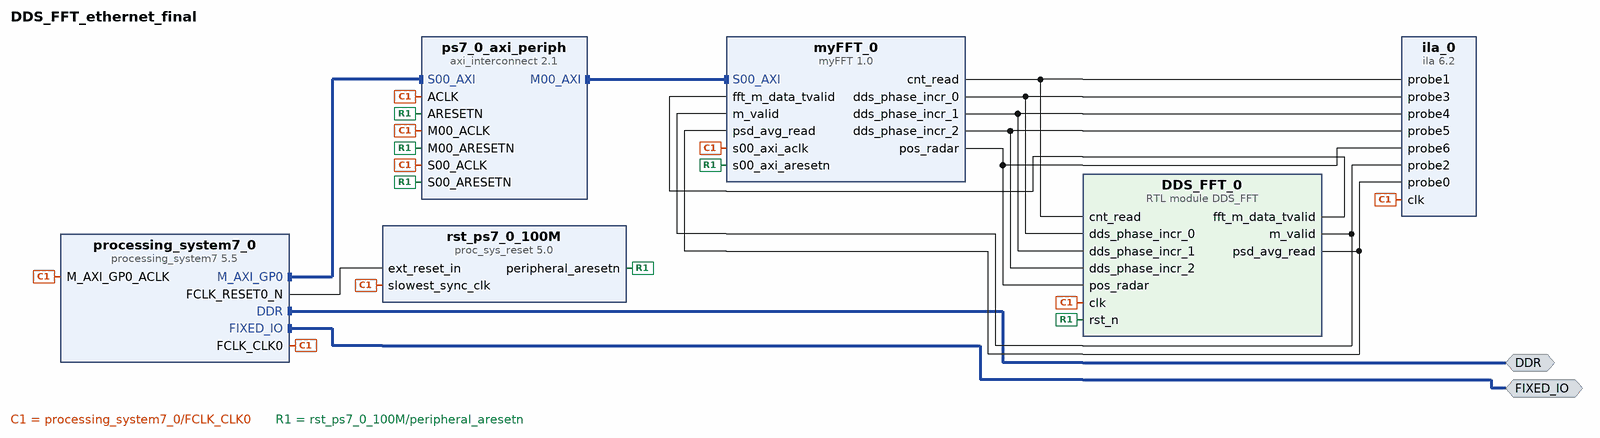
[diagram p0: block diagram of the top level]
# Vivado block design DDS_FFT_ethernet_final, xc7z020clg400-2, Vivado 2022.2
create_bd_design DDS_FFT_ethernet_final

create_bd_intf_port -mode Master -vlnv xilinx.com:interface:ddrx_rtl:1.0 DDR
create_bd_intf_port -mode Master -vlnv xilinx.com:display_processing_system7:fixedio_rtl:1.0 FIXED_IO

create_bd_cell -type ip -vlnv xilinx.com:ip:processing_system7:5.5 processing_system7_0
set_property -dict [list \
  CONFIG.PCW_ENET0_ENET0_IO {MIO 16 .. 27} \
  CONFIG.PCW_ENET0_GRP_MDIO_ENABLE 1 \
  CONFIG.PCW_ENET0_GRP_MDIO_IO {MIO 52 .. 53} \
  CONFIG.PCW_ENET0_PERIPHERAL_ENABLE 1 \
  CONFIG.PCW_ENET0_RESET_ENABLE 0 \
  CONFIG.PCW_ENET_RESET_ENABLE 1 \
  CONFIG.PCW_ENET_RESET_SELECT {Share reset pin} \
  CONFIG.PCW_FPGA0_PERIPHERAL_FREQMHZ 100 \
  CONFIG.PCW_GPIO_MIO_GPIO_ENABLE 1 \
  CONFIG.PCW_GPIO_MIO_GPIO_IO MIO \
  CONFIG.PCW_I2C_RESET_ENABLE 1 \
  CONFIG.PCW_PRESET_BANK1_VOLTAGE {LVCMOS 1.8V} \
  CONFIG.PCW_QSPI_GRP_SINGLE_SS_ENABLE 1 \
  CONFIG.PCW_QSPI_GRP_SINGLE_SS_IO {MIO 1 .. 6} \
  CONFIG.PCW_QSPI_PERIPHERAL_ENABLE 1 \
  CONFIG.PCW_QSPI_QSPI_IO {MIO 1 .. 6} \
  CONFIG.PCW_SINGLE_QSPI_DATA_MODE x4 \
  CONFIG.PCW_UART1_PERIPHERAL_ENABLE 1 \
  CONFIG.PCW_UART1_UART1_IO {MIO 48 .. 49} \
  CONFIG.PCW_UART_PERIPHERAL_FREQMHZ 100 \
  CONFIG.PCW_UIPARAM_DDR_PARTNO {MT41J256M16 RE-125} \
  CONFIG.PCW_USB_RESET_ENABLE 1 \
] [get_bd_cells processing_system7_0]
# 200 more settings of processing_system7_0 are not shown: defaults, MIO pin electricals, DDR timing, and values the tool derives
create_bd_cell -type ip -vlnv xilinx.com:ip:ila:6.2 ila_0
set_property -dict [list \
  CONFIG.C_MONITOR_TYPE Native \
  CONFIG.C_NUM_OF_PROBES 7 \
  CONFIG.C_PROBE0_WIDTH 48 \
  CONFIG.C_PROBE1_WIDTH 10 \
  CONFIG.C_PROBE3_WIDTH 18 \
  CONFIG.C_PROBE4_WIDTH 18 \
  CONFIG.C_PROBE5_WIDTH 18 \
  CONFIG.C_PROBE6_WIDTH 3 \
] [get_bd_cells ila_0]
create_bd_cell -type ip -vlnv xilinx.com:ip:axi_interconnect:2.1 ps7_0_axi_periph
set_property -dict {CONFIG.NUM_MI 1} [get_bd_cells ps7_0_axi_periph]
create_bd_cell -type ip -vlnv xilinx.com:ip:proc_sys_reset:5.0 rst_ps7_0_100M
create_bd_cell -type ip -vlnv xilinx.com:user:myFFT:1.0 myFFT_0
create_bd_cell -type module -reference DDS_FFT DDS_FFT_0

# ---- connections ----

connect_bd_intf_net [get_bd_intf_ports DDR] [get_bd_intf_pins processing_system7_0/DDR]
connect_bd_intf_net [get_bd_intf_ports FIXED_IO] [get_bd_intf_pins processing_system7_0/FIXED_IO]
connect_bd_intf_net [get_bd_intf_pins processing_system7_0/M_AXI_GP0] [get_bd_intf_pins ps7_0_axi_periph/S00_AXI]
connect_bd_intf_net [get_bd_intf_pins ps7_0_axi_periph/M00_AXI] [get_bd_intf_pins myFFT_0/S00_AXI]
connect_bd_net [get_bd_pins DDS_FFT_0/fft_m_data_tvalid] [get_bd_pins myFFT_0/fft_m_data_tvalid]
connect_bd_net [get_bd_pins DDS_FFT_0/m_valid] [get_bd_pins ila_0/probe2] [get_bd_pins myFFT_0/m_valid]
connect_bd_net [get_bd_pins DDS_FFT_0/psd_avg_read] [get_bd_pins ila_0/probe0] [get_bd_pins myFFT_0/psd_avg_read]
connect_bd_net [get_bd_pins myFFT_0/cnt_read] [get_bd_pins ila_0/probe1] [get_bd_pins DDS_FFT_0/cnt_read]
connect_bd_net [get_bd_pins myFFT_0/dds_phase_incr_0] [get_bd_pins ila_0/probe3] [get_bd_pins DDS_FFT_0/dds_phase_incr_0]
connect_bd_net [get_bd_pins myFFT_0/dds_phase_incr_1] [get_bd_pins ila_0/probe4] [get_bd_pins DDS_FFT_0/dds_phase_incr_1]
connect_bd_net [get_bd_pins myFFT_0/dds_phase_incr_2] [get_bd_pins ila_0/probe5] [get_bd_pins DDS_FFT_0/dds_phase_incr_2]
connect_bd_net [get_bd_pins myFFT_0/pos_radar] [get_bd_pins ila_0/probe6] [get_bd_pins DDS_FFT_0/pos_radar]
connect_bd_net [get_bd_pins processing_system7_0/FCLK_CLK0] \
  [get_bd_pins ila_0/clk] [get_bd_pins processing_system7_0/M_AXI_GP0_ACLK] [get_bd_pins ps7_0_axi_periph/S00_ACLK] \
  [get_bd_pins rst_ps7_0_100M/slowest_sync_clk] [get_bd_pins ps7_0_axi_periph/M00_ACLK] [get_bd_pins ps7_0_axi_periph/ACLK] \
  [get_bd_pins myFFT_0/s00_axi_aclk] [get_bd_pins DDS_FFT_0/clk]
connect_bd_net [get_bd_pins processing_system7_0/FCLK_RESET0_N] [get_bd_pins rst_ps7_0_100M/ext_reset_in]
connect_bd_net [get_bd_pins rst_ps7_0_100M/peripheral_aresetn] \
  [get_bd_pins ps7_0_axi_periph/S00_ARESETN] [get_bd_pins ps7_0_axi_periph/M00_ARESETN] \
  [get_bd_pins ps7_0_axi_periph/ARESETN] [get_bd_pins myFFT_0/s00_axi_aresetn] [get_bd_pins DDS_FFT_0/rst_n]

# ---- address map ----
assign_bd_address -offset 0x43C00000 -range 64K -target_address_space [get_bd_addr_spaces processing_system7_0/Data] [get_bd_addr_segs myFFT_0/S00_AXI/S00_AXI_reg]

validate_bd_design
save_bd_design
